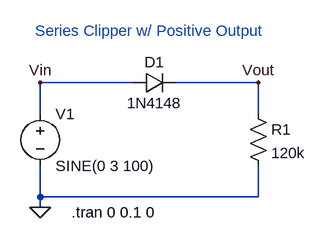
[diagram p0: schematic 2EEB_VELASCO_EXPT4_CKT1.asc]
2EEB_VELASCO_EXPT4_CKT1.asc, the LTspice schematic file:
Version 4
SHEET 1 880 680
WIRE 272 64 128 64
WIRE 464 64 336 64
WIRE 128 112 128 64
WIRE 464 112 464 64
WIRE 128 240 128 192
WIRE 464 240 464 192
WIRE 464 240 128 240
WIRE 128 256 128 240
FLAG 128 256 0
FLAG 128 64 Vin
FLAG 464 64 Vout
SYMBOL voltage 128 96 R0
SYMATTR InstName V1
SYMATTR Value SINE(0 3 100)
SYMBOL diode 272 80 R270
WINDOW 0 32 32 VTop 2
WINDOW 3 0 32 VBottom 2
SYMATTR InstName D1
SYMATTR Value 1N4148
SYMBOL res 448 96 R0
SYMATTR InstName R1
SYMATTR Value 120k
TEXT 176 264 Left 2 !.tran 0 0.1 0
TEXT 120 -16 Left 2 ;Series Clipper w/ Positive Output

The netlist it stands for:
* 2EEB_VELASCO_EXPT4_CKT1.asc
V1 Vin 0 SINE(0 3 100)
D1 Vin Vout 1N4148
R1 Vout 0 120k
.model D D
.lib standard.dio
.tran 0 0.1 0
* Series Clipper w/ Positive Output
.backanno
.end